# EAGLE design rev001 (EAGLE 5.08)
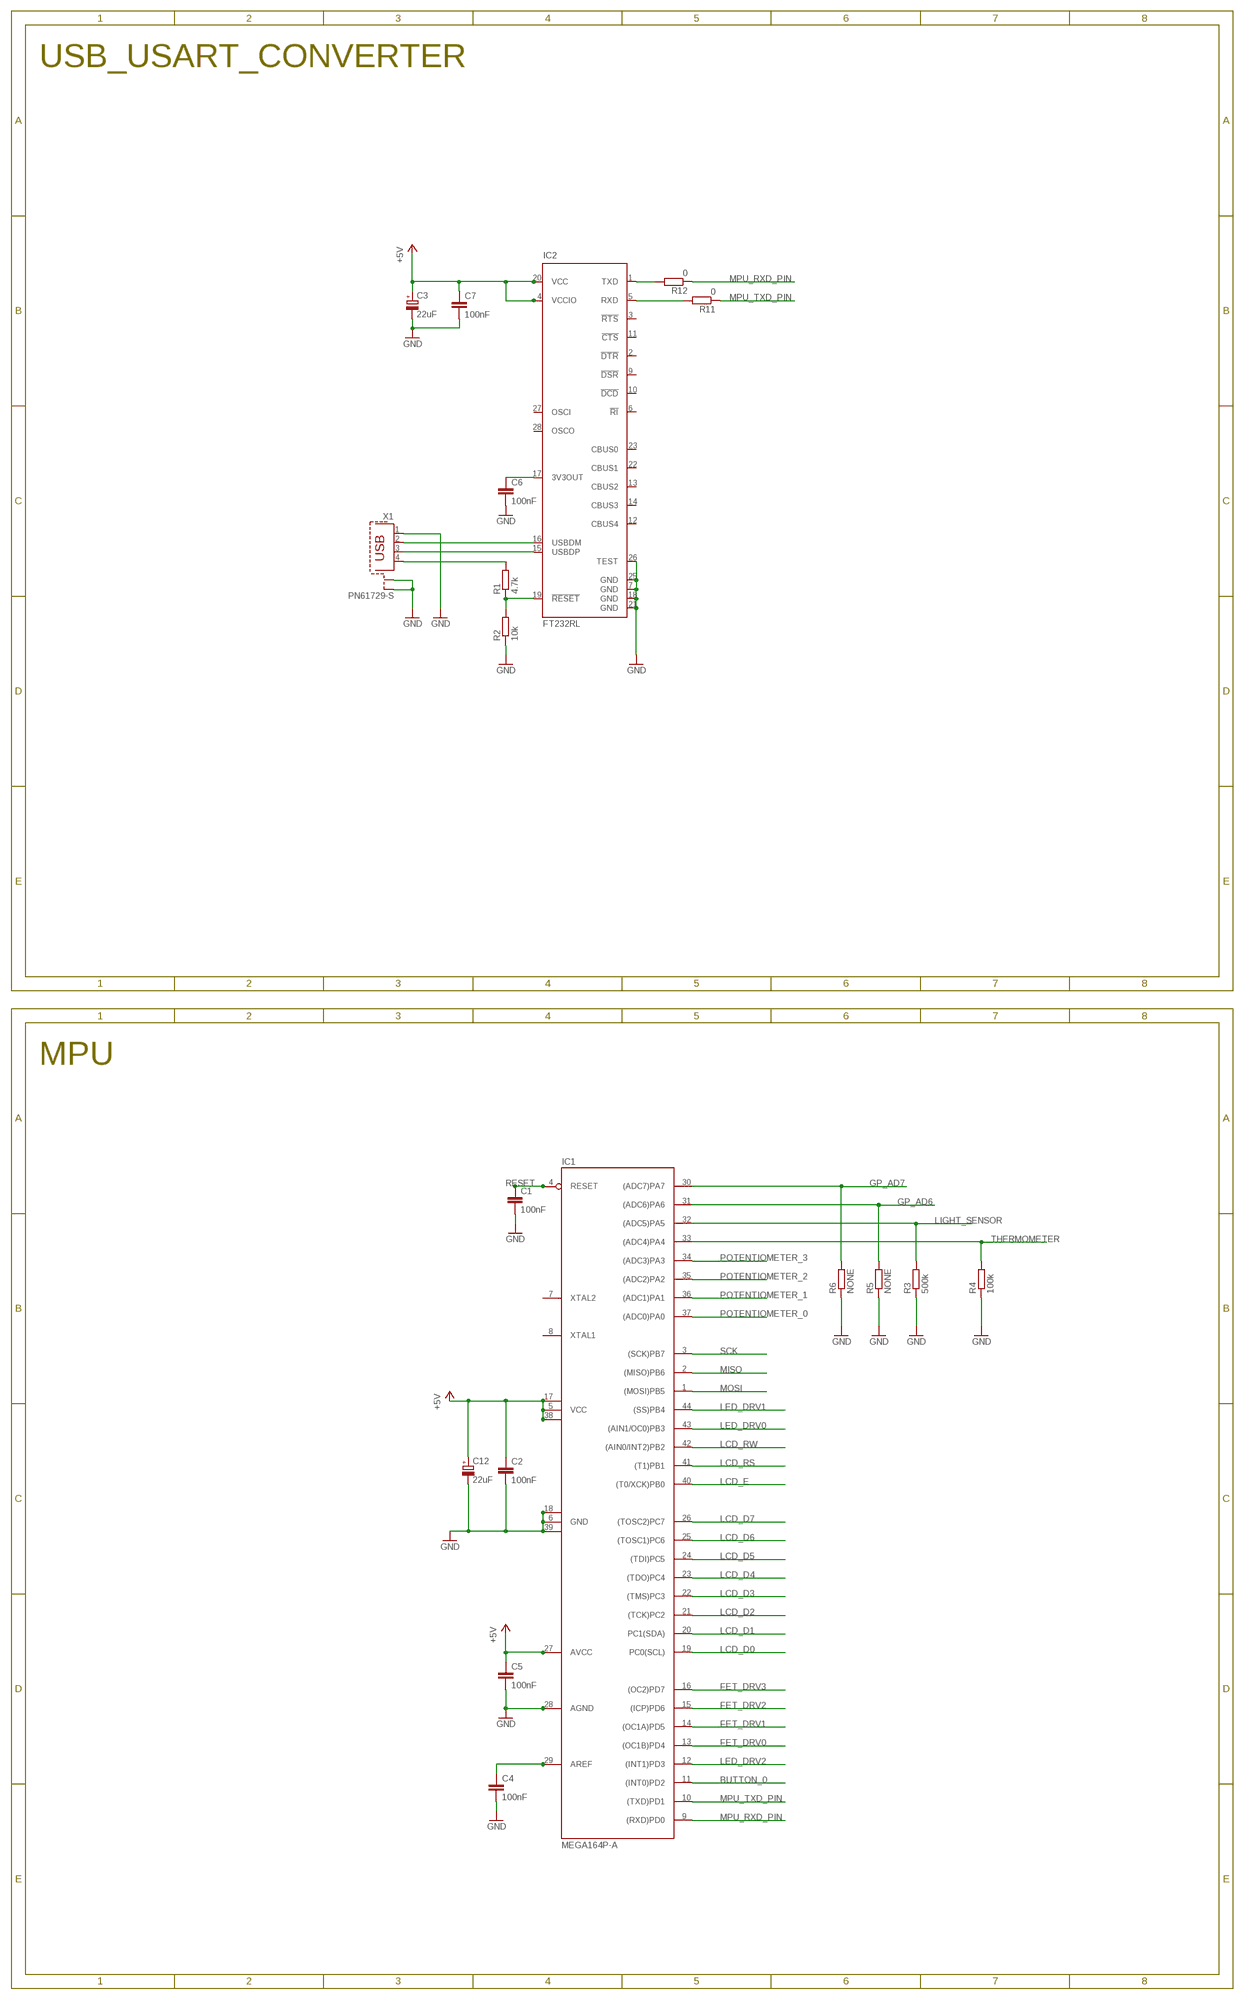
[diagram p0: schematic, sheet 1, part 1 of 2]
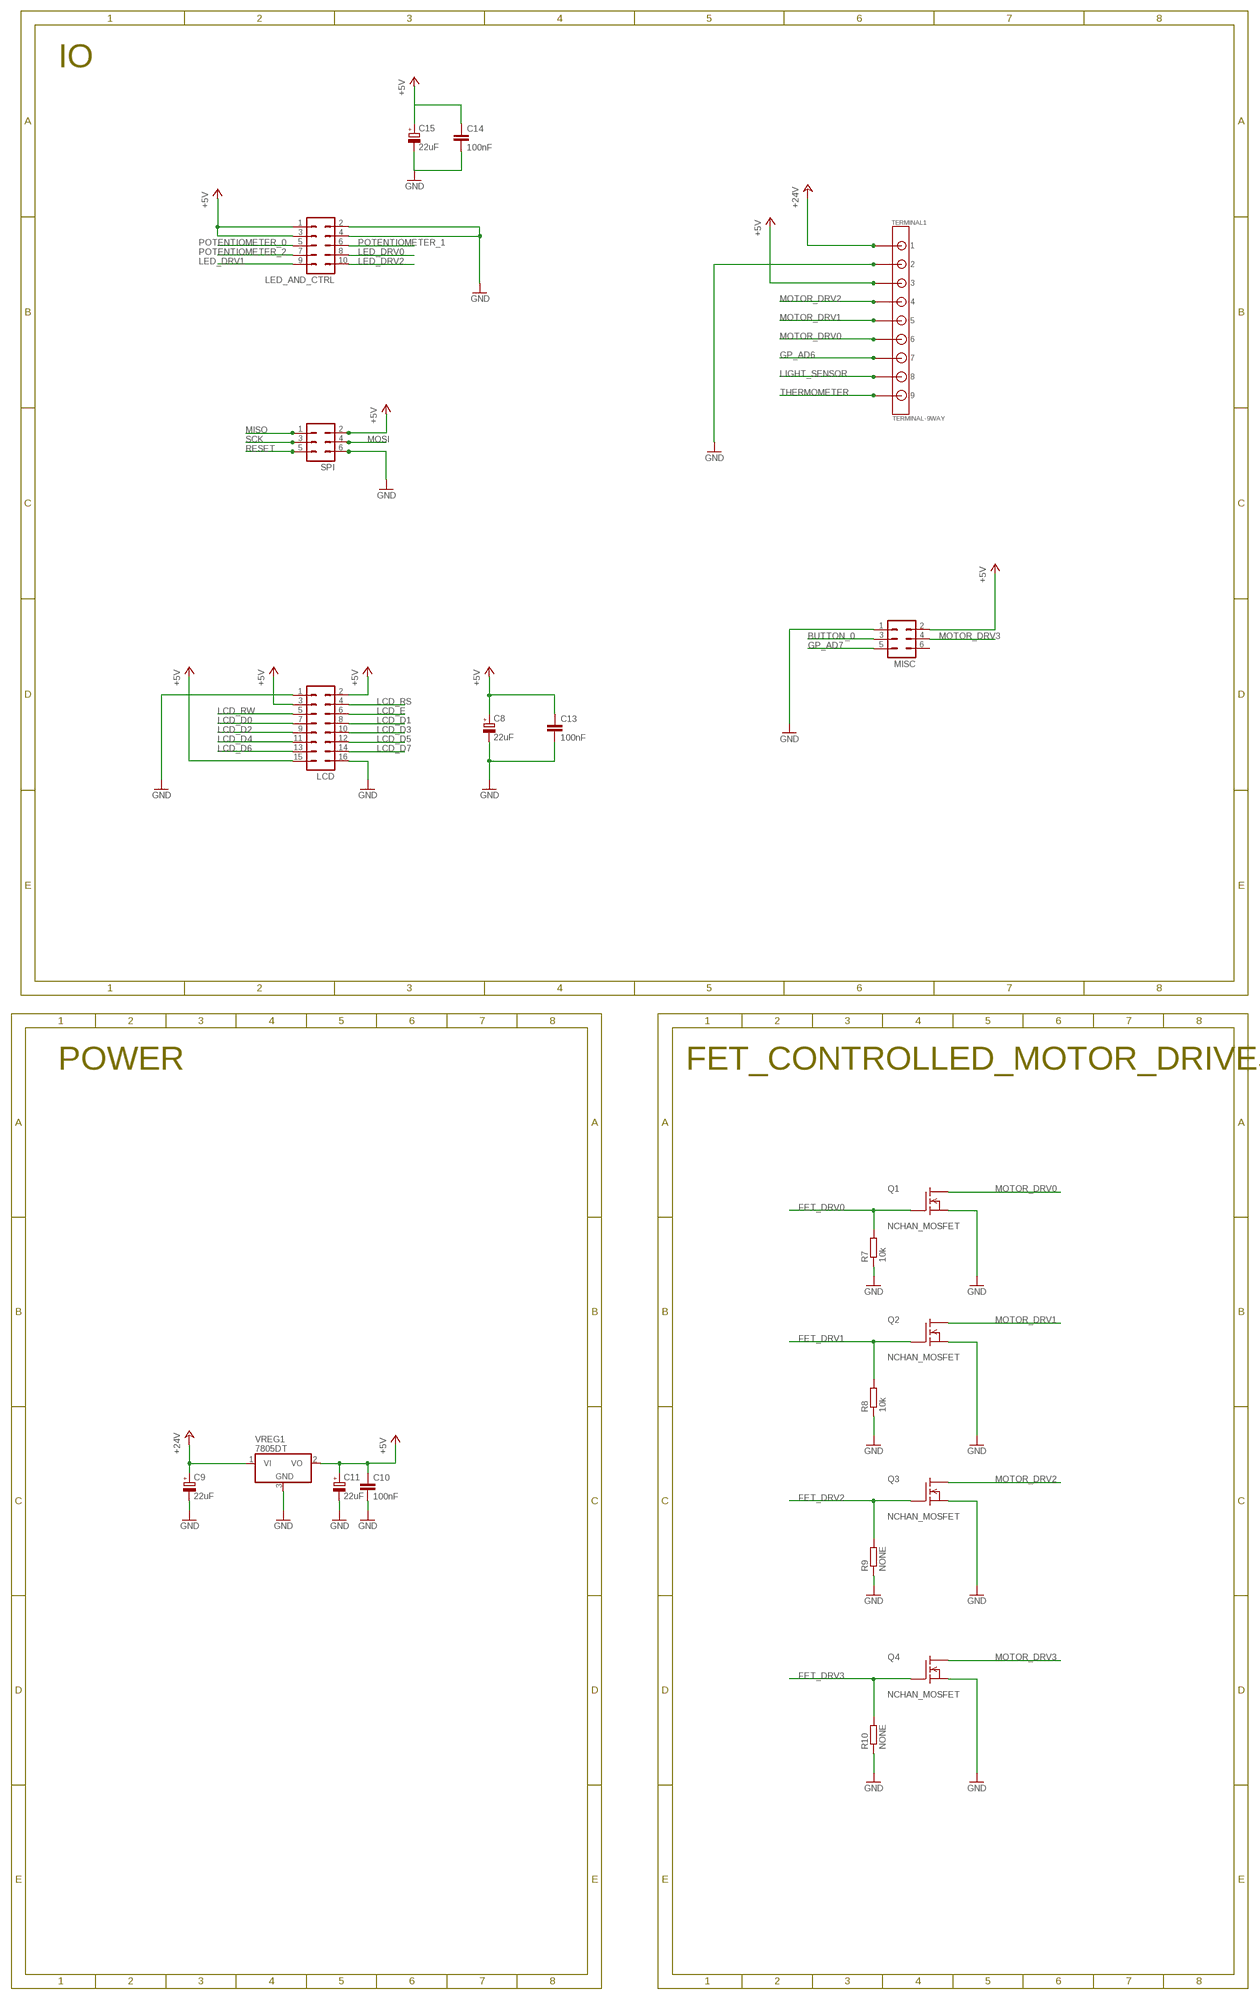
[diagram p1: schematic, sheet 1, part 2 of 2]

## Parts
C1  100nF  C-EUC1206  [C1206]
C2  100nF  C-EUC1206  [C1206]
C3  22uF  CPOL-EUE2.5-6  [E2,5-6]
C4  100nF  C-EUC1206  [C1206]
C5  100nF  C-EUC1206  [C1206]
C6  100nF  C-EUC1206  [C1206]
C7  100nF  C-EUC1206  [C1206]
C8  22uF  CPOL-EUE2.5-6  [E2,5-6]
C9  22uF  CPOL-EUE2.5-6  [E2,5-6]
C10  100nF  C-EUC1206  [C1206]
C11  22uF  CPOL-EUE2.5-6  [E2,5-6]
C12  22uF  CPOL-EUE2.5-6  [E2,5-6]
C13  100nF  C-EUC1206  [C1206]
C14  100nF  C-EUC1206  [C1206]
C15  22uF  CPOL-EUE2.5-6  [E2,5-6]
IC1  MEGA164P-A  [TQFP44]
IC2  FT232RL  [SSOP28]
LCD  MA08-2  [MA08-2]
LED_AND_CTRL  MA05-2  [MA05-2]
MISC  MA03-2  [MA03-2]
Q1  NCHAN_MOSFET  [D2PACK]
Q2  NCHAN_MOSFET  [D2PACK]
Q3  NCHAN_MOSFET  [D2PACK]
Q4  NCHAN_MOSFET  [D2PACK]
R1  4.7k  R-EU_R1206  [R1206]
R2  10k  R-EU_R1206  [R1206]
R3  500k  R-EU_R1206  [R1206]
R4  100k  R-EU_R1206  [R1206]
R5  NONE  R-EU_R1206  [R1206]
R6  NONE  R-EU_R1206  [R1206]
R7  10k  R-EU_R1206  [R1206]
R8  10k  R-EU_R1206  [R1206]
R9  NONE  R-EU_R1206  [R1206]
R10  NONE  R-EU_R1206  [R1206]
R11  0  R-EU_R1206  [R1206]
R12  0  R-EU_R1206  [R1206]
SPI  MA03-2  [MA03-2]
TERMINAL1  TERMINAL-9WAY  [TERMINAL-9WAY]
VREG1  7805DT  [TO252]
X1  PN61729-S  [PN61729-S]

## Nets
+5V: C2.1 C3.+ C5.1 C7.1 C8.+ C10.1 C11.+ C12.+ C13.1 C14.1 C15.+ IC1.5(VCC) IC1.17(VCC1) IC1.27(AVCC) IC1.38(VCC2) IC2.4(VCCIO) IC2.20(VCC) LCD.2 LCD.3 LCD.15 LED_AND_CTRL.1 LED_AND_CTRL.3 MISC.2 SPI.2 TERMINAL1.P$3 VREG1.2(VO)
+24V: C9.+ TERMINAL1.P$1 VREG1.1(VI)
BUTTON_0: IC1.11((INT0)PD2) MISC.3
FET_DRV0: IC1.13((OC1B)PD4) Q1.1(G) R7.2
FET_DRV1: IC1.14((OC1A)PD5) Q2.1(G) R8.2
FET_DRV2: IC1.15((ICP)PD6) Q3.1(G) R9.2
FET_DRV3: IC1.16((OC2)PD7) Q4.1(G) R10.2
GND: C1.2 C2.2 C3.- C4.2 C5.2 C6.2 C7.2 C8.- C9.- C10.2 C11.- C12.- C13.2 C14.2 C15.- IC1.6(GND) IC1.18(GND1) IC1.28(AGND) IC1.39(GND2) IC2.7(GND) IC2.18(GND) IC2.21(GND) IC2.25(GND) IC2.26(TEST) LCD.1 LCD.16 LED_AND_CTRL.2 LED_AND_CTRL.4 MISC.1 Q1.3(S) Q2.3(S) Q3.3(S) Q4.3(S) R2.1 R3.1 R4.1 R5.1 R6.1 R7.1 R8.1 R9.1 R10.1 SPI.6 TERMINAL1.P$2 VREG1.3(GND) X1.1 X1.S1 X1.S2
GP_AD6: IC1.31((ADC6)PA6) R5.2 TERMINAL1.P$7
GP_AD7: IC1.30((ADC7)PA7) MISC.5 R6.2
LCD_D0: IC1.19(PC0(SCL)) LCD.7
LCD_D1: IC1.20(PC1(SDA)) LCD.8
LCD_D2: IC1.21((TCK)PC2) LCD.9
LCD_D3: IC1.22((TMS)PC3) LCD.10
LCD_D4: IC1.23((TDO)PC4) LCD.11
LCD_D5: IC1.24((TDI)PC5) LCD.12
LCD_D6: IC1.25((TOSC1)PC6) LCD.13
LCD_D7: IC1.26((TOSC2)PC7) LCD.14
LCD_E: IC1.40((T0/XCK)PB0) LCD.6
LCD_RS: IC1.41((T1)PB1) LCD.4
LCD_RW: IC1.42((AIN0/INT2)PB2) LCD.5
LED_DRV0: IC1.43((AIN1/OC0)PB3) LED_AND_CTRL.8
LED_DRV1: IC1.44((SS)PB4) LED_AND_CTRL.9
LED_DRV2: IC1.12((INT1)PD3) LED_AND_CTRL.10
LIGHT_SENSOR: IC1.32((ADC5)PA5) R3.2 TERMINAL1.P$8
MISO: IC1.2((MISO)PB6) SPI.1
MOSI: IC1.1((MOSI)PB5) SPI.4
MOTOR_DRV0: Q1.2(D) TERMINAL1.P$6
MOTOR_DRV1: Q2.2(D) TERMINAL1.P$5
MOTOR_DRV2: Q3.2(D) TERMINAL1.P$4
MOTOR_DRV3: MISC.4 Q4.2(D)
MPU_RXD_PIN: IC1.9((RXD)PD0) R12.1
MPU_TXD_PIN: IC1.10((TXD)PD1) R11.1
N$1: C4.1 IC1.29(AREF)
N$4: IC2.1(TXD) R12.2
N$5: IC2.5(RXD) R11.2
N$10: C6.1 IC2.17(3V3OUT)
N$11: IC2.15(USBDP) X1.3
N$12: IC2.16(USBDM) X1.2
N$13: R1.2 X1.4
N$14: IC2.19(!RESET) R1.1 R2.2
POTENTIOMETER_0: IC1.37((ADC0)PA0) LED_AND_CTRL.5
POTENTIOMETER_1: IC1.36((ADC1)PA1) LED_AND_CTRL.6
POTENTIOMETER_2: IC1.35((ADC2)PA2) LED_AND_CTRL.7
POTENTIOMETER_3: IC1.34((ADC3)PA3)
RESET: C1.1 IC1.4(RESET) SPI.5
SCK: IC1.3((SCK)PB7) SPI.3
THERMOMETER: IC1.33((ADC4)PA4) R4.2 TERMINAL1.P$9
Unconnected: IC1.7(XTAL2) IC1.8(XTAL1) IC2.2(!DTR) IC2.3(!RTS) IC2.6(!RI) IC2.9(!DSR) IC2.10(!DCD) IC2.11(!CTS) IC2.12(CBUS4) IC2.13(CBUS2) IC2.14(CBUS3) IC2.22(CBUS1) IC2.23(CBUS0) IC2.27(OSCI) IC2.28(OSCO) MISC.6

## Notes on the sheet
- USB_USART_CONVERTER | IO
- MPU | POWER | FET_CONTROLLED_MOTOR_DRIVES

## Library data of the parts
C1 C2 C4-C7 C10 C13 C14 = hakkeenpoltto-smd:C-EU: CAPACITOR, European symbol
C3 C8 C9 C11 C12 C15 = hakkeenpoltto-smd:CPOL-EU: POLARIZED CAPACITOR, European symbol
IC1 = hakkeenpoltto-smd:MEGA164P: MICROCONTROLLER 32 Kbytes FLASH 2 Kbytes SRAM 1 Kbytes EEPROM USART 8-channel 10 bit ADC Source: avr.lbr
IC2 = hakkeenpoltto-smd:FT232R: Source: http://www.ftdichip.com/Documents/DataSheets/DS_FT232R_v104.pdf
LCD = hakkeenpoltto-smd:MA08-2: PIN HEADER
LED_AND_CTRL = hakkeenpoltto-smd:MA05-2: PIN HEADER
MISC SPI = hakkeenpoltto-smd:MA03-2: PIN HEADER
Q1-Q4 = hakkeenpoltto-smd:NCHAN_MOSFET: N-Channel Enhancement MOSFET 600V 4Vthv
R1-R12 = hakkeenpoltto-smd:R-EU_: RESISTOR, European symbol
TERMINAL1 = hakkeenpoltto-smd:TERMINAL-9WAY: http://fi.farnell.com/tyco-electronics-amp/282836-9/terminal-block-pcb-5mm-9way/dp/3089101?Ntt=3089101
VREG1 = hakkeenpoltto-smd:78*: Positive VOLTAGE REGULATOR http://fi.farnell.com/taiwan-semiconductor/ts78m05cp/v-reg-5-0v-smd-78m05-to-252-3/dp/7207581
X1 = hakkeenpoltto-smd:PN61729-S: BERG USB connector

## Board
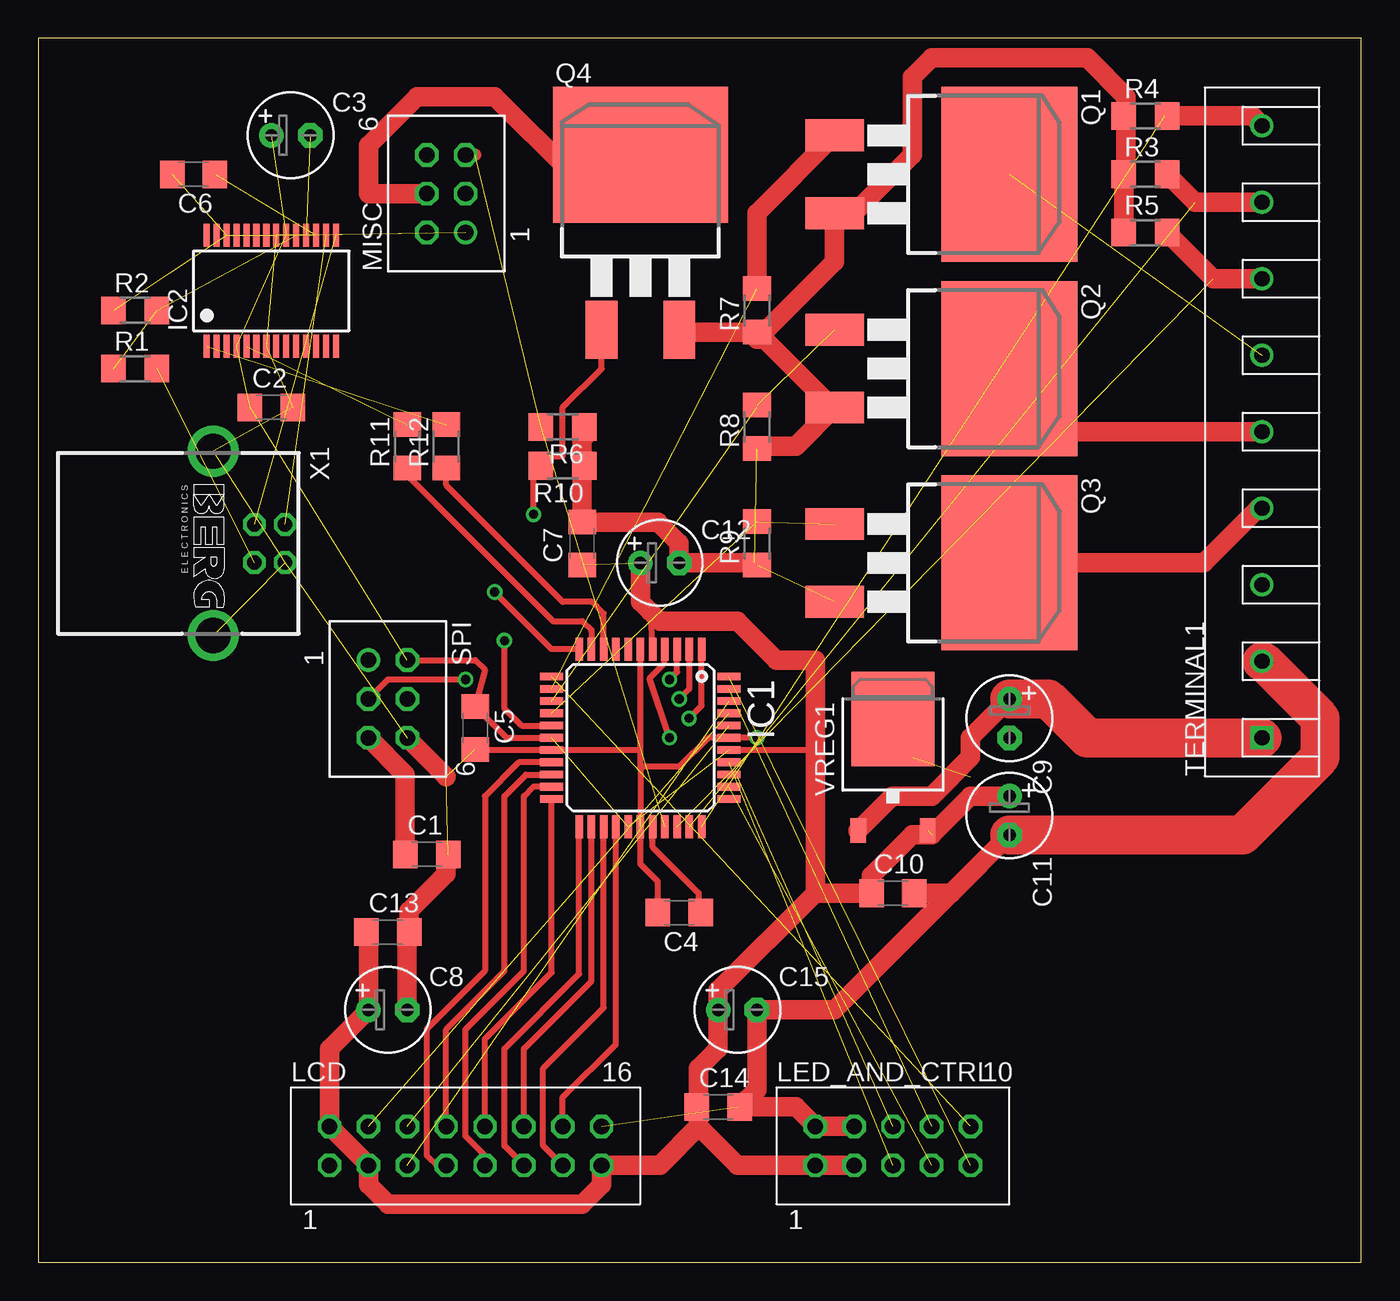
[diagram p2: board, top side]
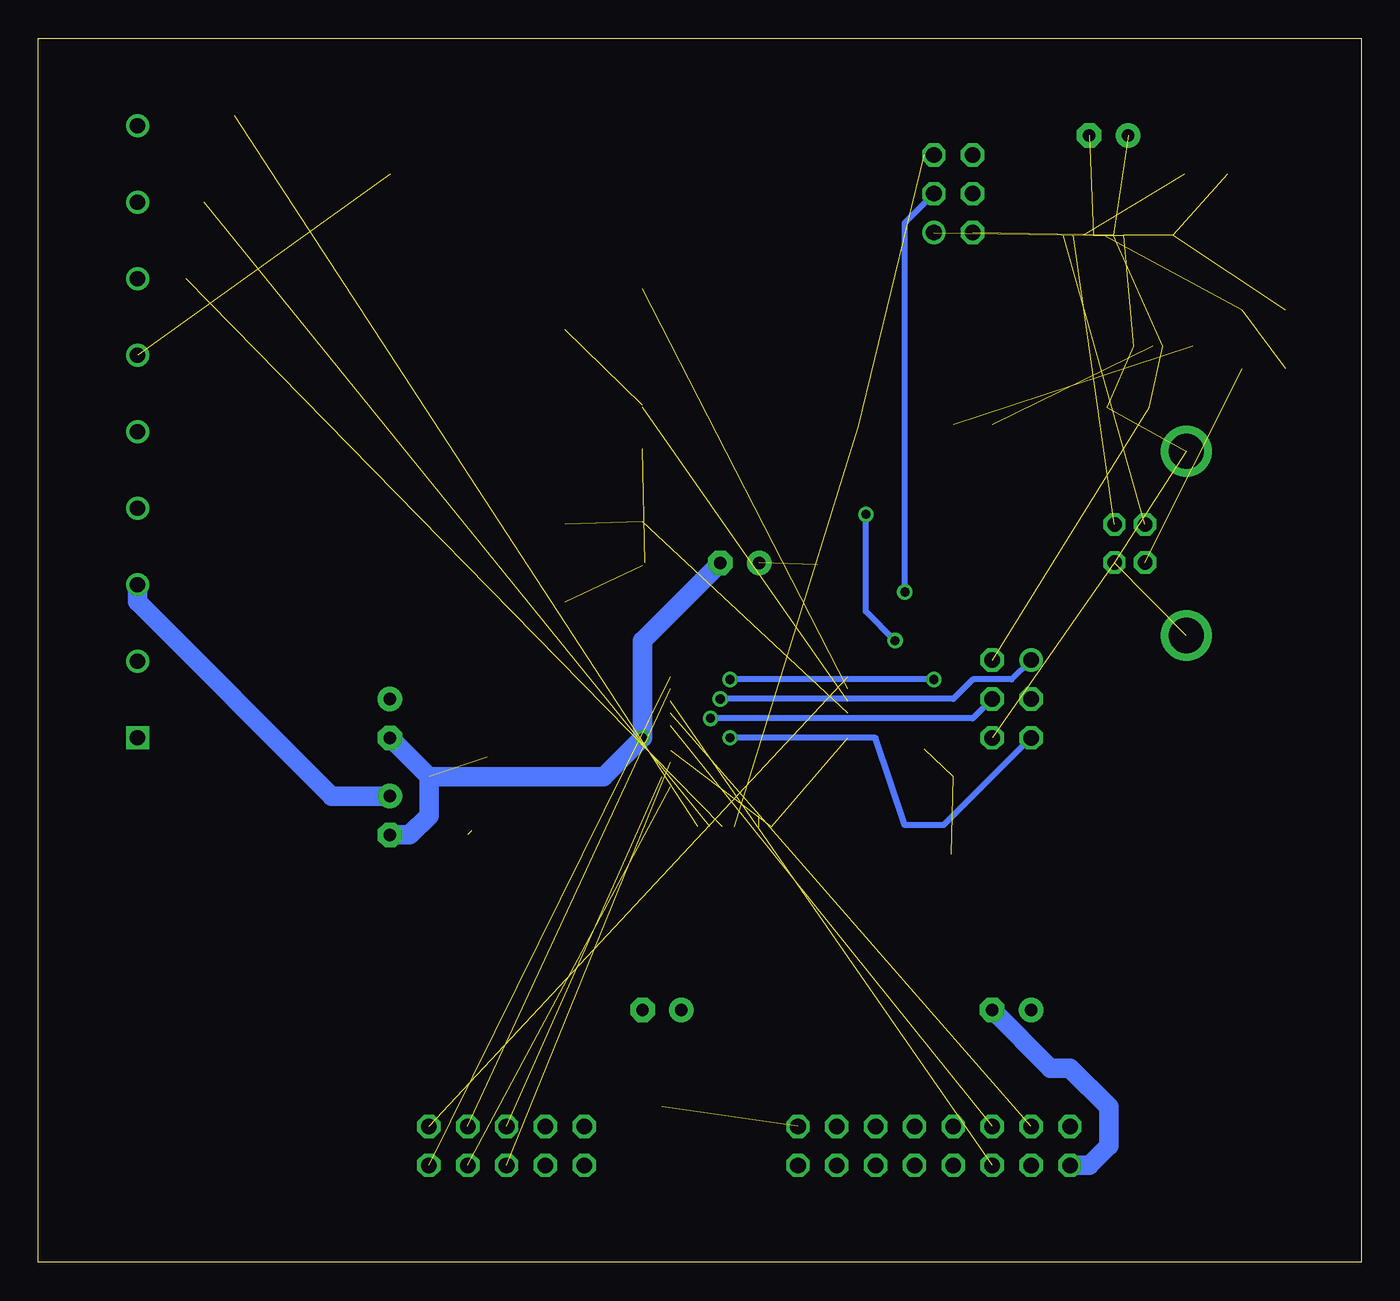
[diagram p3: board, bottom side, seen from below]

Size 86.5 x 80 mm. Coordinates in mm from the lower left corner, seen from the top.
Outline: 0,0 86.5,0 86.5,80 0,80 0,0
Copper layers (1*16): Top 0.035mm / dielectric 1.5mm / Bottom 0.035mm
Design rules "default *": minimum track width 0.2mm, minimum drill 0.4mm, track to track 0.2mm, track to pad 0.2mm, pad to pad 0.2mm, via to via 0.2mm, smd to smd 0.2mm, copper to edge 0.2mm, drill to drill 0.2mm, minimum pad ring 10mil, minimum via ring 8mil, stop-mask expansion 4mil, vias tented up to drill 0mil, thermal gap 10mil
tKeepout: 6 lines

### Footprints (pad centres in the part's own frame; a part is rotated, then mirrored left to right if it is on the bottom)
C1206 = smd 1.6 x 1.8: 1 -1.4,0; 2 1.4,0
E2,5-6 = drill 0.813 pad 1.6 round: + -1.27,0 | drill 0.813 pad 1.6 octagon: - 1.27,0
TQFP44 = smd 1.5 x 0.5: 1 -5.8,4; 2 -5.8,3.2; 3 -5.8,2.4; 4 -5.8,1.6; 5 -5.8,0.8; 6 -5.8,0; 7 -5.8,-0.8; 8 -5.8,-1.6; 9 -5.8,-2.4; 10 -5.8,-3.2; 11 -5.8,-4; 23 5.8,-4; 24 5.8,-3.2; 25 5.8,-2.4; 26 5.8,-1.6; 27 5.8,-0.8; 28 5.8,0; 29 5.8,0.8; 30 5.8,1.6; 31 5.8,2.4; 32 5.8,3.2; 33 5.8,4 | smd 0.5 x 1.5: 12 -4,-5.8; 13 -3.2,-5.8; 14 -2.4,-5.8; 15 -1.6,-5.8; 16 -0.8,-5.8; 17 0,-5.8; 18 0.8,-5.8; 19 1.6,-5.8; 20 2.4,-5.8; 21 3.2,-5.8; 22 4,-5.8; 34 4,5.8; 35 3.2,5.8; 36 2.4,5.8; 37 1.6,5.8; 38 0.8,5.8; 39 0,5.8; 40 -0.8,5.8; 41 -1.6,5.8; 42 -2.4,5.8; 43 -3.2,5.8; 44 -4,5.8
SSOP28 = smd 0.4 x 1.5: 1 -4.225,-3.625; 2 -3.575,-3.625; 3 -2.925,-3.625; 4 -2.275,-3.625; 5 -1.625,-3.625; 6 -0.975,-3.625; 7 -0.325,-3.625; 8 0.325,-3.625; 9 0.975,-3.625; 10 1.625,-3.625; 11 2.275,-3.625; 12 2.925,-3.625; 13 3.575,-3.625; 14 4.225,-3.625; 15 4.225,3.625; 16 3.575,3.625; 17 2.925,3.625; 18 2.275,3.625; 19 1.625,3.625; 20 0.975,3.625; 21 0.325,3.625; 22 -0.325,3.625; 23 -0.975,3.625; 24 -1.625,3.625; 25 -2.275,3.625; 26 -2.925,3.625; 27 -3.575,3.625; 28 -4.225,3.625
MA08-2 = drill 1.016 octagon: 1 -8.89,-1.27; 2 -8.89,1.27; 3 -6.35,-1.27; 4 -6.35,1.27; 5 -3.81,-1.27; 6 -3.81,1.27; 7 -1.27,-1.27; 8 -1.27,1.27; 9 1.27,-1.27; 10 1.27,1.27; 11 3.81,-1.27; 12 3.81,1.27; 13 6.35,-1.27; 14 6.35,1.27; 15 8.89,-1.27; 16 8.89,1.27
MA05-2 = drill 1.016 octagon: 1 -5.08,-1.27; 2 -5.08,1.27; 3 -2.54,-1.27; 4 -2.54,1.27; 5 0,-1.27; 6 0,1.27; 7 2.54,-1.27; 8 2.54,1.27; 9 5.08,-1.27; 10 5.08,1.27
MA03-2 = drill 1.016 round: 1 -2.54,-1.27 | drill 1.016 octagon: 2 -2.54,1.27; 3 0,-1.27; 4 0,1.27; 5 2.54,-1.27; 6 2.54,1.27
D2PACK = smd 2.083 x 3.81: 1 -2.54,-8.89; 3 2.54,-8.89 | smd 11.43 x 8.89: 2 0,2.54
R1206 = smd 1.6 x 1.803: 1 -1.422,0; 2 1.422,0
TERMINAL-9WAY = drill 1 square: P$1 2.54,-3.81 | drill 1 round: P$2 7.54,-3.81; P$3 12.54,-3.81; P$4 17.54,-3.81; P$5 22.54,-3.81; P$6 27.54,-3.81; P$7 32.54,-3.81; P$8 37.54,-3.81; P$9 42.54,-3.81
TO252 = smd 1 x 1.6: 1 -2.28,-4.8; 2 2.28,-4.8 | smd 5.4 x 6.2: 3 0,2.5
PN61729-S = drill 0.95 octagon: 1 1.25,4.71; 2 -1.25,4.71; 3 -1.25,2.71; 4 1.25,2.71 | drill 2.3 pad 2.9 round: S1 -6.02,0; S2 6.02,0

### Placement (x,y rotation side)
C1  25.4,26.67 0 top
C2  15.24,55.88 0 top
C3  16.51,73.66 0 top
C4  41.91,22.86 180 top
C5  28.57,34.92 270 top
C6  10.16,71.12 180 top
C7  35.56,46.99 90 top
C8  22.86,16.51 0 top
C9  63.5,35.56 270 top
C10  55.88,24.13 0 top
C11  63.5,29.21 270 top
C12  40.64,45.72 0 top
C13  22.86,21.59 0 top
C14  44.45,10.16 0 top
C15  45.72,16.51 0 top
IC1  39.37,34.29 270 top
IC2  15.24,63.5 0 top
LCD  27.94,7.62 0 top
LED_AND_CTRL  55.88,7.62 0 top
MISC  26.67,69.85 90 top
Q1  60.96,71.12 270 top
Q2  60.96,58.42 270 top
Q3  60.96,45.72 270 top
Q4  39.37,69.85 0 top
R1  6.35,58.42 0 top
R2  6.35,62.23 0 top
R3  72.39,71.12 0 top
R4  72.39,74.93 0 top
R5  72.39,67.31 0 top
R6  34.29,54.61 180 top
R7  46.99,62.23 90 top
R8  46.99,54.61 90 top
R9  46.99,46.99 90 top
R10  34.29,52.07 180 top
R11  24.13,53.34 90 top
R12  26.67,53.34 90 top
SPI  22.86,36.83 270 top
TERMINAL1  76.2,31.75 90 top
VREG1  55.88,33.02 0 top
X1  11.43,46.99 270 top

### Tracks (layer width: path | path; a pad name or v marks a point on that pad's centre or on a via)
+5V  (9 unrouted)
  Top 0.406: 40.01,42.55 IC1.5 | SPI.2 28.57,39.37 29.21,38.73 C5.1 30.61,34.29 IC1.17 | IC1.38 50.33,33.49 50.8,33.02
  Top 1.27: C11.+ 60.96,30.48 58.42,27.94 57.15,27.94 54.48,25.27 C10.1 50.8,24.13 | 50.8,24.13 44.45,17.78 C15.+ 44.45,13.97 43.18,12.7 43.18,10.29 | 43.18,10.29 C14.1 | 43.18,8.89 43.18,10.29 | 43.18,8.89 45.72,6.35 LED_AND_CTRL.1 LED_AND_CTRL.3 | 43.18,8.89 40.64,6.35 LCD.15 36.83,5.08 35.56,3.81 22.86,3.81 21.59,5.08 LCD.3 LCD.2 19.05,13.97 C8.+ 21.59,21.46 C13.1 | 50.8,24.13 50.8,33.02 50.8,39.37 48.26,39.37 45.72,41.91 40.64,41.91 40.01,42.55 39.37,43.18 C12.+
  Bottom 1.27: TERMINAL1.P$3 80.01,43.18 67.31,30.48 C11.+
+24V
  Top 1.27: C9.+ 60.96,34.29 60.96,33.02 58.42,30.48 55.86,30.48 VREG1.1
  Top 2.54: TERMINAL1.P$1 68.58,34.29 66.04,36.83 C9.+
BUTTON_0  (via drill 0.6)
  Top 0.406: IC1.11 33.57,40.09 v29.84,43.81
  Bottom 0.406: v29.84,43.81 29.84,67.94 MISC.3
FET_DRV0  (1 unrouted)
  Top 1.27: R7.2 46.99,68.58 Q1.1
FET_DRV1  (2 unrouted)
  Top 0.2: R8.2 46.99,55.88
FET_DRV2  (2 unrouted)
FET_DRV3  (via drill 0.6)
  Top 0.406: IC1.16 31.59,35.09 30.48,36.2 v30.48,40.64 | v32.38,48.9 32.38,51.59 R10.2 33.5,52.7 34.29,52.7 34.29,55.88 36.83,58.42 Q4.1
  Bottom 0.406: v30.48,40.64 32.38,42.55 v32.38,48.9
GND  (via drill 0.6)  (20 unrouted)
  Top 0.2: 57.15,33.02 55.88,34.29 VREG1.3 | C10.2 57.15,24.13 | C14.2 45.72,10.16
  Top 0.406: v46.99,34.29 IC1.39 43.81,34.29 41.91,32.38 39.37,32.38 | 39.37,32.38 39.37,33.48 | 39.37,32.38 39.37,29.21 | 39.37,33.48 IC1.18 28.61,33.49 C5.2 | 39.37,33.48 IC1.6 | C4.2 40.51,24.89 39.37,26.04 IC1.28 | 35.71,54.13 R6.1 | R10.1 35.71,53.98 35.71,54.13 | 35.71,54.13 36.2,54.61
  Top 1.27: C10.2 59.69,24.13 C11.- 52.07,16.51 C15.- 46.99,11.3 C14.2 | 45.72,10.16 49.53,10.16 LED_AND_CTRL.2 LED_AND_CTRL.4 | C8.- 24.13,21.46 C13.2 24.26,22.99 26.67,25.4 26.67,26.54 C1.2 | 71.12,74.93 71.12,71.27 R3.1 R5.1 | 71.12,74.93 R4.1 | 71.12,74.93 71.12,76.2 68.58,78.74 58.42,78.74 57.15,77.47 57.15,72.39 53.34,68.58 Q1.3 52.07,65.41 46.99,60.33 47.47,60.33 | R8.1 46.99,53.34 49.53,53.34 Q2.3 51.92,55.88 47.47,60.33 | 47.47,60.33 R7.1 42.06,60.81 Q4.3 | R9.1 46.84,45.72 C12.- 41.91,46.99 40.51,48.39 C7.2 35.56,53.82 35.71,53.98 | SPI.6 26.67,31.75
  Top 2.54: TERMINAL1.P$2 80.09,39.29 83.82,35.56 83.82,33.02 78.74,27.94 C11.-
  Bottom 1.27: 60.96,31.75 C9.- | 60.96,31.75 60.96,29.21 62.23,27.94 C11.- | C8.- 20.32,12.7 19.05,12.7 16.51,10.16 16.51,7.62 17.78,6.35 LCD.1 | C12.- 46.99,40.64 v46.99,34.29 49.53,31.75 60.96,31.75
GP_AD6  (1 unrouted)
  Top 1.27: TERMINAL1.P$7 76.83,64.29 R5.2
GP_AD7  (2 unrouted)
  Top 0.813: MISC.5 28.57,72.39
LCD_D0
  Top 0.406: IC1.19 31.42,32.69 29.21,30.48 29.21,19.05 25.4,15.24 25.4,6.99 26.04,6.35 LCD.7
LCD_D1
  Top 0.406: IC1.20 31.89,31.89 30.48,30.48 30.48,19.05 26.67,15.24 LCD.8
LCD_D2
  Top 0.406: LCD.9 29.21,6.99 27.94,8.26 27.94,15.24 31.75,19.05 31.75,30.48 32.38,31.11 33.55,31.11 IC1.21
LCD_D3
  Top 0.406: IC1.22 33.57,18.96 29.21,14.61 LCD.10
LCD_D4
  Top 0.406: IC1.23 35.37,18.86 30.48,13.97 30.48,7.62 LCD.11
LCD_D5
  Top 0.406: IC1.24 36.17,18.39 31.75,13.97 LCD.12
LCD_D6
  Top 0.406: IC1.25 36.97,16.65 33.02,12.7 33.02,7.62 LCD.13
LCD_D7
  Top 0.406: IC1.26 37.77,14.28 34.29,10.79 LCD.14
LCD_E  (1 unrouted)
LCD_RS  (1 unrouted)
LCD_RW  (1 unrouted)
LED_DRV0  (1 unrouted)
LED_DRV1  (1 unrouted)
LED_DRV2  (1 unrouted)
LIGHT_SENSOR  (1 unrouted)
  Top 1.27: TERMINAL1.P$8 75.64,69.29 R3.2
MISO  (via drill 0.6)
  Top 0.406: IC1.2 42.57,37.49 v41.91,36.83
  Bottom 0.406: v41.91,36.83 26.67,36.83 25.4,38.1 22.86,38.1 SPI.1
MOSI  (via drill 0.6)
  Top 0.406: IC1.1 43.37,36.38 v42.55,35.56
  Bottom 0.406: v42.55,35.56 25.4,35.56 SPI.4
MOTOR_DRV0  (1 unrouted)
MOTOR_DRV1
  Top 1.27: TERMINAL1.P$5 67.63,54.29 Q2.2
MOTOR_DRV2
  Top 1.27: TERMINAL1.P$4 79.77,49.29 76.2,45.72 Q3.2
MOTOR_DRV3
  Top 0.2: 39.37,71.12 Q4.2
  Top 1.27: 39.37,71.12 34.92,71.12 29.84,76.2 24.77,76.2 21.59,73.03 21.59,69.85 MISC.4
MPU_RXD_PIN
  Top 0.406: IC1.9 36.97,42.41 36.2,43.18 34.29,43.18 26.67,50.8 R12.1
MPU_TXD_PIN
  Top 0.406: IC1.10 36.17,41.25 36.2,41.27 35.56,41.91 33.66,41.91 24.13,51.44 R11.1
N$1
  Top 0.406: 43.18,22.86 C4.1 43.18,22.99 43.18,24.13 40.17,27.14 IC1.29
N$4  (1 unrouted)
N$5  (1 unrouted)
N$10  (1 unrouted)
N$11  (1 unrouted)
N$12  (1 unrouted)
N$13  (1 unrouted)
N$14  (2 unrouted)
POTENTIOMETER_0  (1 unrouted)
POTENTIOMETER_1  (1 unrouted)
  Top 0.2: IC1.36 45.72,31.75
POTENTIOMETER_2  (1 unrouted)
RESET  (via drill 0.6)
  Top 0.406: IC1.4 40.94,39.16 39.98,38.2 v41.27,34.29
  Top 1.27: C1.1 24,31.88 SPI.5
  Bottom 0.406: v41.27,34.29 31.75,34.29 29.84,28.57 27.3,28.57 SPI.5
SCK  (via drill 0.6)
  Top 0.406: IC1.3 41.77,38.59 v41.27,38.1 | v27.94,38.1 22.86,38.1 SPI.3
  Bottom 0.406: v27.94,38.1 v41.27,38.1
THERMOMETER  (1 unrouted)
  Top 0.2: R4.2 73.66,74.93
  Top 1.27: TERMINAL1.P$9 79.37,74.93 R4.2